# EAGLE design Industrial Switcher (EAGLE 6.4)
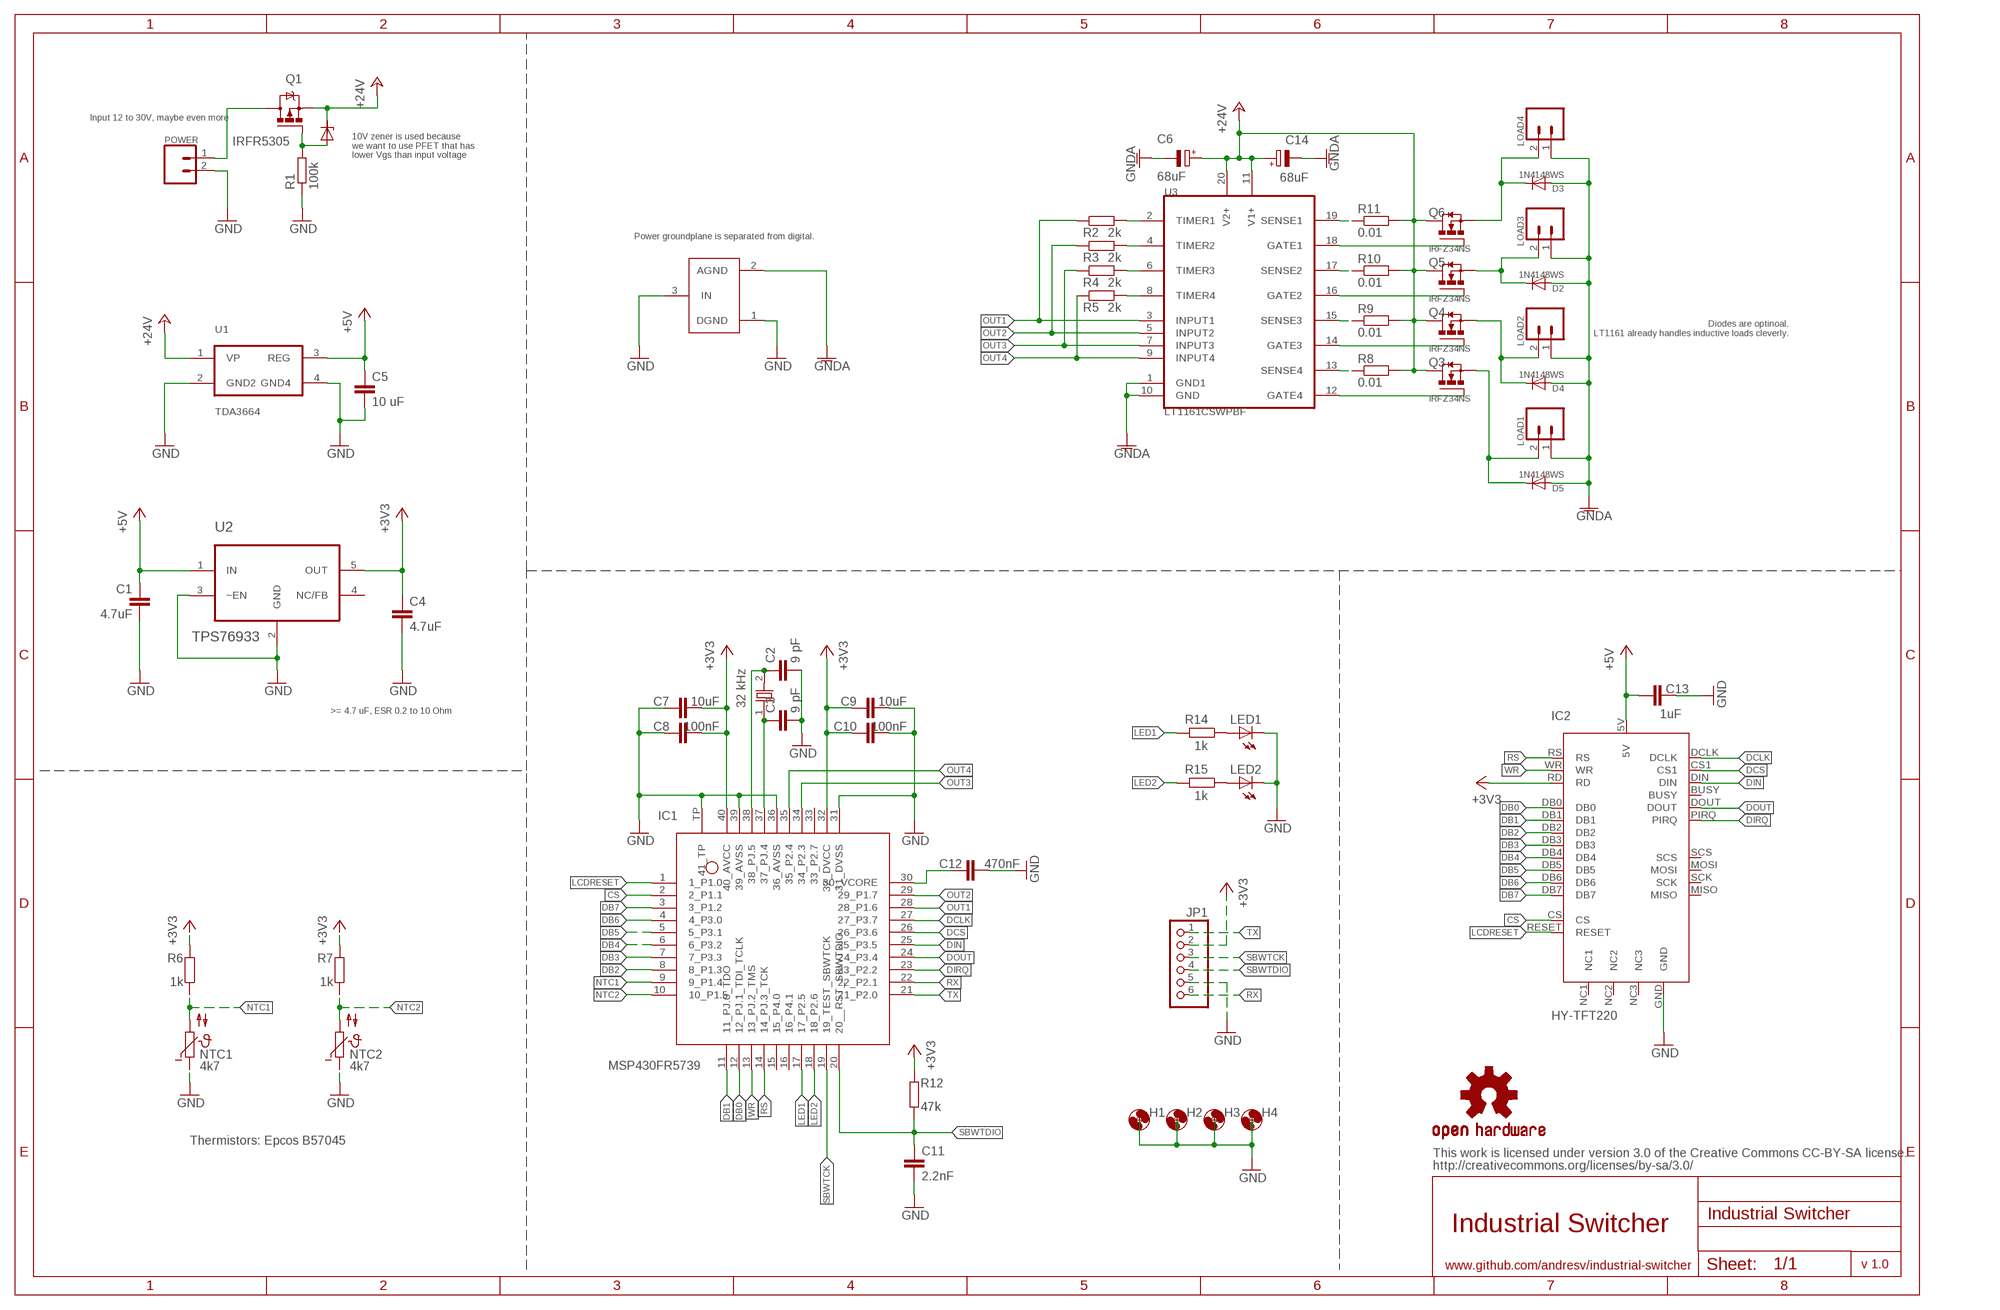
[diagram p0: schematic, sheet 1]

## Parts
C1  4.7uF  C-EUC0805  [C0805]
C2  9 pF  C-EUC0402  [C0402]
C3  9 pF  C-EUC0402  [C0402]
C4  4.7uF  C-EUC1206  [C1206]
C5  10 uF  C-EUC1206  [C1206]
C6  68uF  CPOL-EUF  [PANASONIC_F]
C7  10uF  C-EUC0603  [C0603]
C8  100nF  C-EUC0603  [C0603]
C9  10uF  C-EUC0603  [C0603]
C10  100nF  C-EUC0603  [C0603]
C11  2.2nF  C-EUC0402  [C0402]
C12  470nF  C-EUC0603  [C0603]
C13  1uF  C-EUC0805  [C0805]
C14  68uF  CPOL-EUF  [PANASONIC_F]
D1  10V  ZDIODE-SOD323  [SOD323-W]
D2  1N4148WS  DIODE-SOD323-W  [SOD323-W]
D3  1N4148WS  DIODE-SOD323-W  [SOD323-W]
D4  1N4148WS  DIODE-SOD323-W  [SOD323-W]
D5  1N4148WS  DIODE-SOD323-W  [SOD323-W]
H1  MOUNT-HOLE3.0  [3,0]
H2  MOUNT-HOLE3.0  [3,0]
H3  MOUNT-HOLE3.0  [3,0]
H4  MOUNT-HOLE3.0  [3,0]
IC1  MSP430FR5739  FR57XX--RHA40RHAPACKAGE  [RHA40]
IC2  HY-TFT220  2.2TFT  [2.2TFT]
JP1  PINHD-1X6  [1X06]
LED1  LEDCHIP-LED0603  [CHIP-LED0603]
LED2  LEDCHIP-LED0603  [CHIP-LED0603]
LOAD1  M025MM  [SCREWTERMINAL-5MM-2]
LOAD2  M025MM  [SCREWTERMINAL-5MM-2]
LOAD3  M025MM  [SCREWTERMINAL-5MM-2]
LOAD4  M025MM  [SCREWTERMINAL-5MM-2]
LOGO2  OSHW-LOGOL  [OSHW-LOGO-L]
NTC1  4k7  NTC640-9  [N640]
NTC2  4k7  NTC640-9  [N640]
POWER  M025MM  [SCREWTERMINAL-5MM-2]
Q1  IRFR5305  [D-PAK_TO252AA]
Q2  32 kHz  ABS07  [ABS07]
Q3  IRFZ34NS  IRF3704S  [D2PACK]
Q4  IRFZ34NS  IRF3704S  [D2PACK]
Q5  IRFZ34NS  IRF3704S  [D2PACK]
Q6  IRFZ34NS  IRF3704S  [D2PACK]
R1  100k  R-EU_R0603  [R0603]
R2  2k  R-EU_R0603  [R0603]
R3  2k  R-EU_R0603  [R0603]
R4  2k  R-EU_R0603  [R0603]
R5  2k  R-EU_R0603  [R0603]
R6  1k  R-EU_R0603  [R0603]
R7  1k  R-EU_R0603  [R0603]
R8  0.01  R-EU_R0603  [R0603]
R9  0.01  R-EU_R0603  [R0603]
R10  0.01  R-EU_R0603  [R0603]
R11  0.01  R-EU_R0603  [R0603]
R12  47k  R-EU_R0402  [R0402]
R14  1k  R-EU_R0402  [R0402]
R15  1k  R-EU_R0402  [R0402]
U1  TDA3664  295-TDA3664/N1,135  [DRFRIEDPARTS/DOAAZ]
U2  TPS76933  TPS76933DBVT  [SOT95P280X145-5N]
U3  LT1161CSWPBF  337-LT1161CSWPBF  [ANDRESV/B3JU7]
U$1  GND_CONNECT  [GND_CONNECT]

## Nets
+3V3: C4.1 C7.2 C8.2 C9.1 C10.1 IC1.32(32_DVCC) IC1.40(40_AVCC) IC2.RD JP1.2 R6.2 R7.2 R12.2 U2.5(OUT)
+5V: C1.1 C5.1 C13.2 IC2.5V U1.3(REG) U2.1(IN)
+24V: C6.+ C14.+ D1.C Q1.3(S) Q3.2(D) Q4.2(D) Q5.2(D) Q6.2(D) R8.2 R9.2 R10.2 R11.2 U1.1(VP) U3.11(V1+) U3.20(V2+)
CS: IC1.2(2_P1.1) IC2.CS
DB0: IC1.12(12_PJ.1_TDI_TCLK) IC2.DB0
DB1: IC1.11(11_PJ.0_TDO) IC2.DB1
DB2: IC1.8(8_P1.3) IC2.DB2
DB3: IC1.7(7_P3.3) IC2.DB3
DB4: IC1.6(6_P3.2) IC2.DB4
DB5: IC1.5(5_P3.1) IC2.DB5
DB6: IC1.4(4_P3.0) IC2.DB6
DB7: IC1.3(3_P1.2) IC2.DB7
DCLK: IC1.27(27_P3.7) IC2.DCLK
DCS: IC1.26(26_P3.6) IC2.CS1
DIN: IC1.25(25_P3.5) IC2.DIN
DIRQ: IC1.23(23_P2.2) IC2.PIRQ
DOUT: IC1.24(24_P3.4) IC2.DOUT
GND: C1.2 C2.2 C3.2 C4.2 C5.2 C7.1 C8.1 C9.2 C10.2 C11.2 C12.2 C13.1 IC1.31(31_DVSS) IC1.36(36_AVSS) IC1.39(39_AVSS) IC1.TP(41_TP) IC2.GND JP1.5 LED1.C LED2.C NTC1.1 NTC2.1 POWER.2 R1.1 U1.2(GND2) U1.4(GND4) U2.2(GND) U2.3(~EN) U$1.1(DGND) U$1.3(IN)
GNDA: C6.- C14.- D2.A D3.A D4.A D5.A LOAD1.1 LOAD2.1 LOAD3.1 LOAD4.1 U3.1(GND1) U3.10(GND) U$1.2(AGND)
LCDRESET: IC1.1(1_P1.0) IC2.RESET
LED1: IC1.17(17_P2.5) R14.2
LED2: IC1.18(18_P2.6) R15.2
N$2: D1.A Q1.1(G) R1.2
N$3: R5.2 U3.8(TIMER4)
N$4: R8.1 U3.13(SENSE4)
N$5: R9.1 U3.15(SENSE3)
N$6: D3.C LOAD4.2 Q6.3(S)
N$7: R10.1 U3.17(SENSE2)
N$8: R4.2 U3.6(TIMER3)
N$9: D2.C LOAD3.2 Q5.3(S)
N$10: R11.1 U3.19(SENSE1)
N$11: R3.2 U3.4(TIMER2)
N$12: D4.C LOAD2.2 Q4.3(S)
N$13: POWER.1 Q1.4(D)
N$14: R2.2 U3.2(TIMER1)
N$15: D5.C LOAD1.2 Q3.3(S)
N$18: Q6.1(G) U3.18(GATE1)
N$19: C3.1 IC1.37(37_PJ.4) Q2.1
N$20: C2.1 IC1.38(38_PJ.5) Q2.2
N$21: C12.1 IC1.30(30_VCORE)
N$23: Q5.1(G) U3.16(GATE2)
N$24: Q4.1(G) U3.14(GATE3)
N$25: Q3.1(G) U3.12(GATE4)
N$26: LED1.A R14.1
N$27: LED2.A R15.1
NTC1: IC1.9(9_P1.4) NTC1.2 R6.1
NTC2: IC1.10(10_P1.5) NTC2.2 R7.1
OUT1: IC1.28(28_P1.6) R2.1 U3.3(INPUT1)
OUT2: IC1.29(29_P1.7) R3.1 U3.5(INPUT2)
OUT3: IC1.34(34_P2.3) R4.1 U3.7(INPUT3)
OUT4: IC1.35(35_P2.4) R5.1 U3.9(INPUT4)
RS: IC1.14(14_PJ.3_TCK) IC2.RS
RX: IC1.22(22_P2.1) JP1.6
SBWTCK: IC1.19(19_TEST_SBWTCK) JP1.3
SBWTDIO: C11.1 IC1.20(20__RST_SBWTDIO) JP1.4 R12.1
TX: IC1.21(21_P2.0) JP1.1
WR: IC1.13(13_PJ.2_TMS) IC2.WR
Unconnected: IC1.15(15_P4.0) IC1.16(16_P4.1) IC1.33(33_P2.7) IC2.BUSY IC2.MISO IC2.MOSI IC2.NC1 IC2.NC2 IC2.NC3 IC2.SCK IC2.SCS U2.4(NC/FB)

## Notes on the sheet
- Input 12 to 30V, maybe even more
- 10V zener is used because
  we want to use PFET that has
  lower Vgs than input voltage
- Power groundplane is separated from digital.
- Diodes are optinoal.
  LT1161 already handles inductive loads cleverly.
- >= 4.7 uF, ESR 0.2 to 10 Ohm
- Thermistors: Epcos B57045
- This work is licensed under version 3.0 of the Creative Commons CC-BY-SA license.
- http://creativecommons.org/licenses/by-sa/3.0/
- Industrial Switcher
- www.github.com/andresv/industrial-switcher | v 1.0

## Library data of the parts
C1-C5 C7-C13 = rcl:C-EU: CAPACITOR, European symbol
C6 C14 = rcl:CPOL-EU: POLARIZED CAPACITOR, European symbol
D1 = General:ZDIODE-SOD323: Z DIODE
D2-D5 = diode:DIODE-: DIODE
H1-H4 = holes:MOUNT-HOLE: MOUNTING HOLE with drill center marker
IC1 = TI_MSP430_v16:FR57XX--RHA40: *** MSP430FR57xx *** 40-PIN RHA (QFN) ***
IC2 = General:2.2TFT: http://www.ebay.com/itm/2-2-TFT-LCD-Module-Touch-Panel-Screen-PCB-Adpater-SD-Card-Cage-/170734608691?pt=LH_DefaultDomain_0&hash=item27c0936133
JP1 = pinhead:PINHD-1X6: PIN HEADER
LED1 LED2 = led:LED: LED OSRAM: - CHIPLED LG R971, LG N971, LY N971, LG Q971, LY Q971, LO R971, LY R971 LH N974, LH R974 LS Q976, LO Q976, LY Q976 LO Q996 - Hyper CHIPLED LW Q18S LB Q993, LB Q99A, LB R99A - SideLED LS A670, LO A670, LY A670, LG A670, LP A670 LB A673, LV A673, LT A673, LW A673 LH A674 LY A675 LS A676, LA A676, LO A676, LY A676, LW A676 LS A679, LY A679, LG A679 - Hyper Micro SIDELED® LS Y876, LA Y876, LO Y876, LY Y876 LT Y87S - SmartLED LW L88C, LW L88S LB L89C, LB L89S, LG L890 LS L89K, LO L89K, LY L89K LS L896, LA L896, LO L896, LY L896 - TOPLED LS T670, LO T670, LY T670, LG T670, LP T670 LSG T670, LSP T670, LSY T670, LOP T670, LYG T670 LG T671, LOG T671, LSG T671 LB T673, LV T673, LT T673, LW T673 LH T674 LS T676, LA T676, LO T676, LY T676, LB T676, LH T676, LSB T676, LW T676 LB T67C, LV T67C, LT T67C, LS T67K, LO T67K, LY T67K, LW E67C LS E67B, LA E67B, LO E67B, LY E67B, LB E67C, LV E67C, LT E67C LW T67C LS T679, LY T679, LG T679 LS T770, LO T770, LY T770, LG T770, LP T770 LB T773, LV T773, LT T773, LW T773 LH T774 LS E675, LA E675, LY E675, LS T675 LS T776, LA T776, LO T776, LY T776, LB T776 LHGB T686 LT T68C, LB T68C - Hyper Mini TOPLED® LB M676 - Mini TOPLED Santana® LG M470 LS M47K, LO M47K, LY M47K Source: http://www.osram.convergy.de LUXEON: - LUMILED® LXK2-PW12-R00, LXK2-PW12-S00, LXK2-PW14-U00, LXK2-PW14-V00 LXK2-PM12-R00, LXK2-PM12-S00, LXK2-PM14-U00 LXK2-PE12-Q00, LXK2-PE12-R00, LXK2-PE12-S00, LXK2-PE14-T00, LXK2-PE14-U00 LXK2-PB12-K00, LXK2-PB12-L00, LXK2-PB12-M00, LXK2-PB14-N00, LXK2-PB14-P00, LXK2-PB14-Q00 LXK2-PR12-L00, LXK2-PR12-M00, LXK2-PR14-Q00, LXK2-PR14-R00 LXK2-PD12-Q00, LXK2-PD12-R00, LXK2-PD12-S00 LXK2-PH12-R00, LXK2-PH12-S00 LXK2-PL12-P00, LXK2-PL12-Q00, LXK2-PL12-R00 Source: www.luxeon.com KINGBRIGHT: KA-3528ASYC Source: www.kingbright.com
LOAD1-LOAD4 POWER = SparkFun:M02: Header 2 Standard 2-pin 0.1" header. Use with straight break away headers (SKU : PRT-00116), right angle break away headers (PRT-00553), swiss pins (PRT-00743), machine pins (PRT-00117), and female headers (PRT-00115). Molex polarized connector foot print use with SKU : PRT-08233 with associated crimp pins and housings.
LOGO2 = SparkFun-Aesthetics:OSHW-LOGO: Open Source Hardware Logo This logo indicates the piece of hardware it is found on incorporates a OSHW license and/or adheres to the definition of open source hardware found here: http://freedomdefined.org/OSHW
NTC1 NTC2 = ptc-ntc:NTC640-9: PHILIPS NTC; OC_FARNELL: unknown; OC_NEWARK: unknown
Q1 = transistor-power:IRF?5305: HEXFET Power MOSFET Source: http://www.irf.com/product-info/datasheets/data/irfr5305pbf.pdf
Q2 = abracon_crystals:ABS07
Q3-Q6 = transistor-power:IRF3704: SMPS MOSFET HEXFET® Power MOSFET Source: http://www.irf.com/product-info/datasheets/data/irf3704.pdf
R1-R12 R14 R15 = rcl:R-EU_: RESISTOR, European symbol
U1 = CircuitHub:295-TDA3664/N1,135; URL: https://circuithub.com/parts/NS/TDA3664%2FN1%2C135
U2 = TPS76933:TPS76933DBVT: ULTRALOW-POWER 100-mA LOW-DROPOUT LINEAR REGULATORS; MPN: TPS76933DBVT; OC_FARNELL: 8461538; OC_NEWARK: 77C1165; PACKAGE: SOT-23-5; SUPPLIER: Texas Instruments
U3 = CircuitHub:337-LT1161CSWPBF; URL: https://circuithub.com/parts/LINEAR/LT1161CSW%23PBF
U$1 = SparkFun-Passives:GND_CONNECT: Use to make a connection of multiple grounds in only one place.

## Board
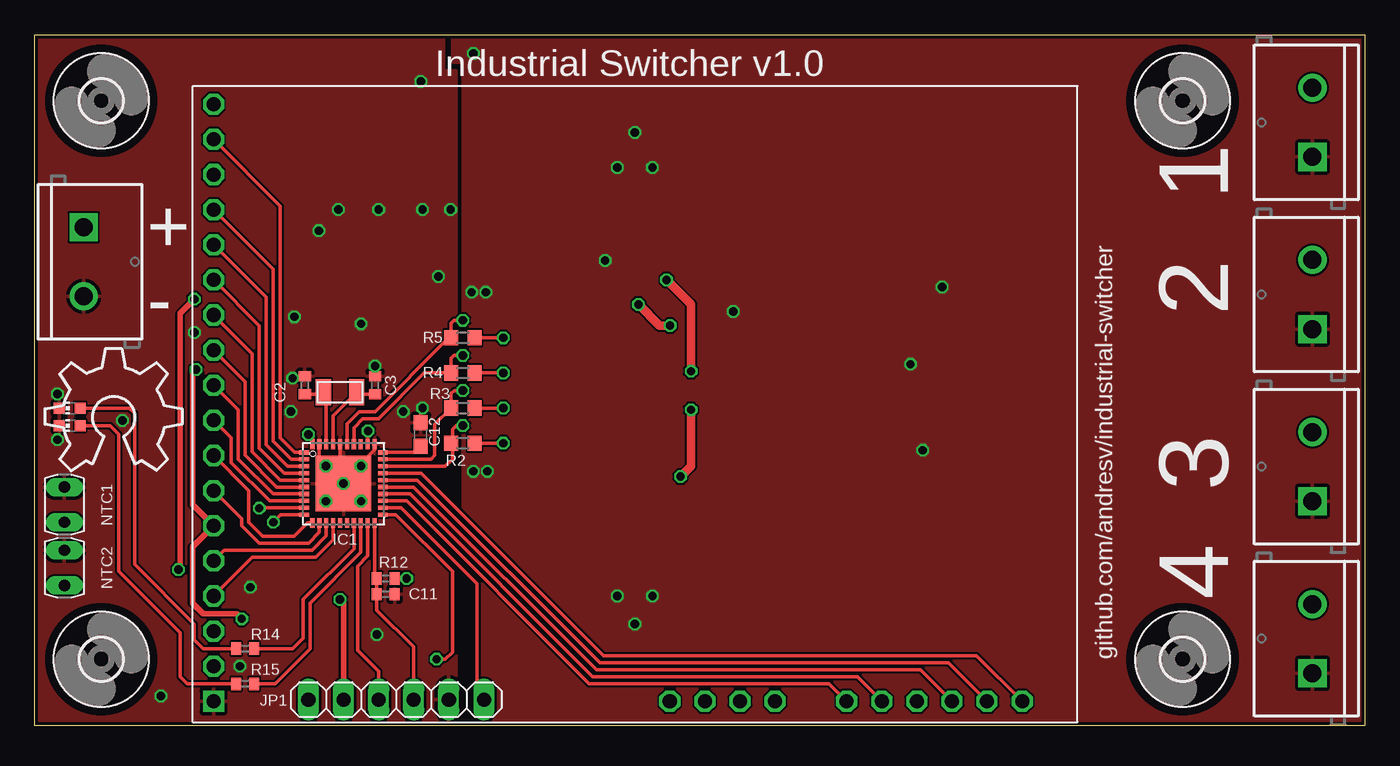
[diagram p1: board, top side]
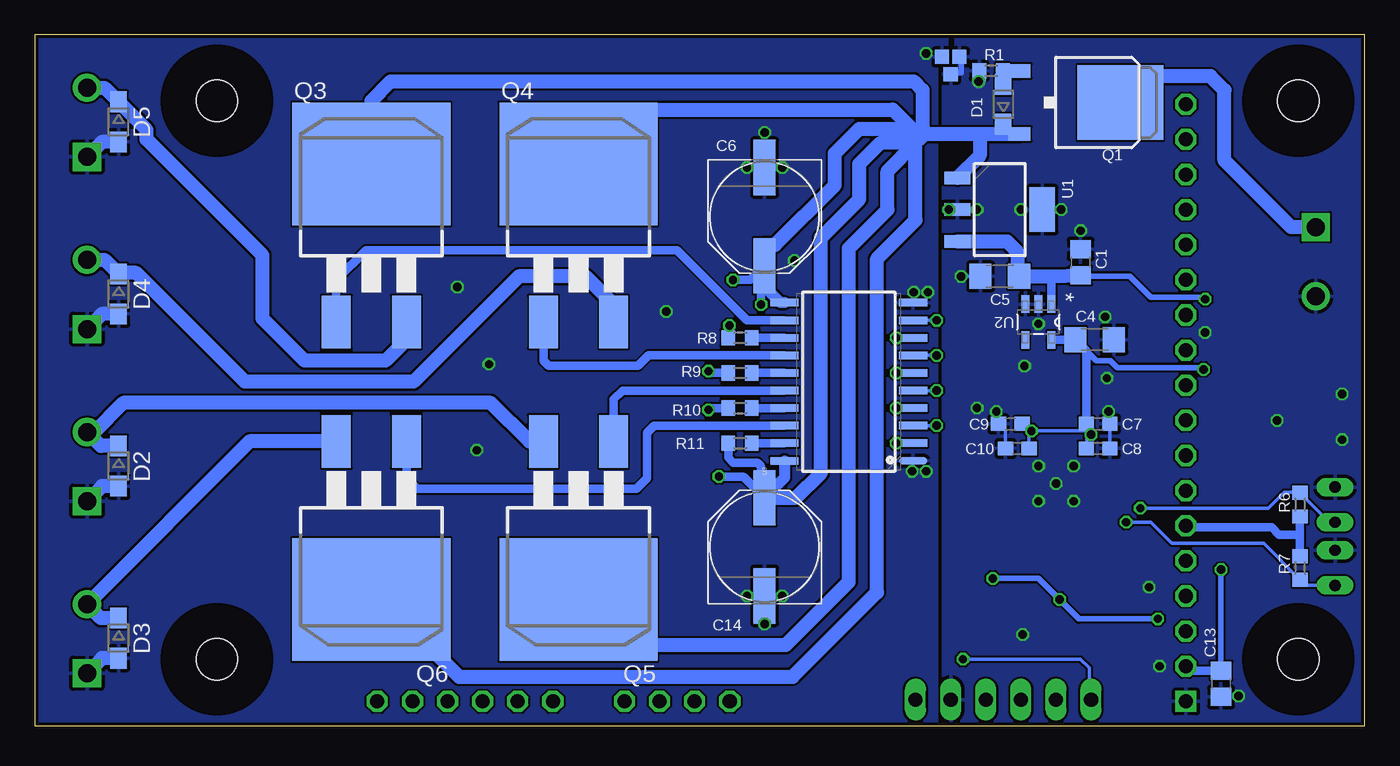
[diagram p2: board, bottom side, seen from below]

Size 96.25 x 50 mm. Coordinates in mm from the lower left corner, seen from the top.
Outline: 0,0 0,50 96.25,50 96.25,0 0,0
Copper layers (1*16): Top 0.035mm / dielectric 1.5mm / Bottom 0.035mm
Design rules "ITEADstudio_DRC": minimum track width 6mil, minimum drill 12mil, track to track 6mil, track to pad 6mil, pad to pad 6mil, via to via 6mil, smd to smd 0mil, copper to edge 10mil, drill to drill 10mil, minimum pad ring 10mil, minimum via ring 6mil, stop-mask expansion 2mil, vias tented up to drill 100mil, thermal gap 10mil

### Footprints (pad centres in the part's own frame; a part is rotated, then mirrored left to right if it is on the bottom)
C0805 = smd 1.3 x 1.5: 1 -0.95,0; 2 0.95,0
C0402 = smd 0.7 x 0.9: 1 -0.65,0; 2 0.65,0
C1206 = smd 1.6 x 1.8: 1 -1.4,0; 2 1.4,0
PANASONIC_F = smd 4 x 1.6: + 3.55,0; - -3.55,0
C0603 = smd 1.1 x 1: 1 -0.85,0; 2 0.85,0
SOD323-W = smd 1.5 x 1.2: A 1.45,0; C -1.45,0
3,0 = hole 3: 0,0
RHA40 = smd 0.7 x 0.3: 1 -2.85,2.25; 2 -2.85,1.75; 3 -2.85,1.25; 4 -2.85,0.75; 5 -2.85,0.25; 6 -2.85,-0.25; 7 -2.85,-0.75; 8 -2.85,-1.25; 9 -2.85,-1.75; 10 -2.85,-2.25; 21 2.85,-2.25; 22 2.85,-1.75; 23 2.85,-1.25; 24 2.85,-0.75; 25 2.85,-0.25; 26 2.85,0.25; 27 2.85,0.75; 28 2.85,1.25; 29 2.85,1.75; 30 2.85,2.25 | smd 0.3 x 0.7: 11 -2.25,-2.85; 12 -1.75,-2.85; 13 -1.25,-2.85; 14 -0.75,-2.85; 15 -0.25,-2.85; 16 0.25,-2.85; 17 0.75,-2.85; 18 1.25,-2.85; 19 1.75,-2.85; 20 2.25,-2.85; 31 2.25,2.85; 32 1.75,2.85; 33 1.25,2.85; 34 0.75,2.85; 35 0.25,2.85; 36 -0.25,2.85; 37 -0.75,2.85; 38 -1.25,2.85; 39 -1.75,2.85; 40 -2.25,2.85 | smd 4 x 4: TP 0,0
2.2TFT = drill 1.016 octagon: 5V -2.54,0; BUSY 0,50.88; CS -35.56,0; CS1 0,55.96; DB0 -15.24,0; DB1 -17.78,0; DB2 -20.32,0; DB3 -22.86,0; DB4 -25.4,0; DB5 -27.94,0; DB6 -30.48,0; DB7 -33.02,0; DCLK 0,58.5; DIN 0,53.42; DOUT 0,48.34; MISO 0,33; MOSI 0,38.08; NC1 -5.08,0; NC2 -38.1,0; NC3 -43.18,0; PIRQ 0,45.8; RD -12.7,0; RESET -40.64,0; RS -7.62,0; SCK 0,35.54; SCS 0,40.62; WR -10.16,0 | drill 1.016 square: GND 0,0
1X06 = drill 1.016 long: 1 -6.35,0; 2 -3.81,0; 3 -1.27,0; 4 1.27,0; 5 3.81,0; 6 6.35,0
CHIP-LED0603 = smd 0.8 x 0.8: A 0,-0.75; C 0,0.75
SCREWTERMINAL-5MM-2 = drill 1.3 pad 2.032 square: 1 0,0 | drill 1.3 pad 2.032: 2 5,0
N640 = drill 0.813 long: 1 -1.27,0; 2 1.27,0
D-PAK_TO252AA = smd 1 x 1.6: 1 -2.28,-4.8; 3 2.28,-4.8 | smd 5.4 x 6.2: 4 0,2.5
ABS07 = smd 1.1 x 1.9: 1 1.2,0; 2 -1.2,0
D2PACK = smd 2.083 x 3.81: 1 -2.54,-8.89; 3 2.54,-8.89 | smd 11.43 x 8.89: 2 0,2.54
R0603 = smd 1 x 1.1: 1 -0.85,0; 2 0.85,0
R0402 = smd 0.7 x 0.9: 1 -0.65,0; 2 0.65,0
DRFRIEDPARTS/DOAAZ = smd 0.91 x 1.876: 1 -2.3,-3.062; 2 0,-3.062; 3 2.3,-3.062 | smd 3.21 x 1.876: 4 0,3.062
SOT95P280X145-5N = smd 1.27 x 0.559: 1 -1.295,0.94; 2 -1.295,0; 3 -1.295,-0.94; 4 1.295,-0.94; 5 1.295,0.94
ANDRESV/B3JU7 = smd 0.542 x 2.041: 1 -5.715,-4.651; 2 -4.445,-4.651; 3 -3.175,-4.651; 4 -1.905,-4.651; 5 -0.635,-4.651; 6 0.635,-4.651; 7 1.905,-4.651; 8 3.175,-4.651; 9 4.445,-4.651; 10 5.715,-4.651; 11 5.715,4.651; 12 4.445,4.651; 13 3.175,4.651; 14 1.905,4.651; 15 0.635,4.651; 16 -0.635,4.651; 17 -1.905,4.651; 18 -3.175,4.651; 19 -4.445,4.651; 20 -5.715,4.651
GND_CONNECT = smd 1.016 x 1.016: 1 -1.016,0; 2 -1.016,-1.27; 3 0.254,-0.635

### Placement (x,y rotation side)
C1  20.57,33.53 90 bottom
C2  19.56,24.64 90 top
C3  24.64,24.64 90 top
C4  19.56,27.94 0 bottom
C5  26.42,32.51 180 bottom
C6  43.43,36.83 270 bottom
C7  19.3,21.84 180 bottom
C8  19.3,20.07 180 bottom
C9  25.65,21.84 180 bottom
C10  25.15,20.07 180 bottom
C11  25.4,9.53 0 top
C12  27.94,21.08 90 top
C13  10.41,3.05 90 bottom
C14  43.43,12.95 90 bottom
D1  26.16,44.96 90 bottom
D2  90.17,18.8 270 bottom
D3  90.17,6.35 270 bottom
D4  90.17,31.24 270 bottom
D5  90.17,43.69 270 bottom
H1  83.06,45.21 0 top
H2  83.06,4.83 0 top
H3  4.83,4.83 0 top
H4  4.83,45.21 0 top
IC1  22.35,17.53 0 top
IC2  12.95,1.78 270 top
JP1  26.16,1.91 0 top
LED1  2.54,22.99 90 top
LED2  2.54,21.72 90 top
LOAD1  92.46,41.15 90 top
LOAD2  92.46,28.7 90 top
LOAD3  92.46,16.26 90 top
LOAD4  92.46,3.81 90 top
LOGO1  OSHW_LOGO_8MILX0350-NT  [OSHW_8X350_NOTEXT]  0.77,18.45 0 top
NTC1  2.16,16 270 top
NTC2  2.16,11.43 270 top
POWER  3.56,36.07 270 top
Q1  20.19,45.09 270 bottom
Q2  22.1,24.13 0 top
Q3  71.88,38.1 0 bottom
Q4  56.9,38.1 0 bottom
Q5  56.9,11.68 180 bottom
Q6  71.88,11.68 180 bottom
R1  27.05,47.37 0 bottom
R2  30.99,20.45 0 top
R3  30.99,22.99 0 top
R4  30.99,25.53 0 top
R5  30.99,28.07 0 top
R6  4.7,16 270 bottom
R7  4.7,11.43 90 bottom
R8  45.21,28.07 180 bottom
R9  45.21,25.53 180 bottom
R10  45.21,22.99 180 bottom
R11  45.21,20.45 180 bottom
R12  25.4,10.67 0 top
R14  15.24,5.59 0 top
R15  15.24,3.05 0 top
U1  26.42,37.34 270 bottom
U2  23.62,29.21 270 bottom
U3  37.34,24.89 90 bottom
U$1  29.34,47.37 270 bottom

### Tracks (layer width: path | path; a pad name or v marks a point on that pad's centre or on a via)
+3V3  (via drill 0.6)
  Top 0.254: IC1.40 20.1,20.79 v19.81,21.08 | IC1.32 24.1,21.31 v24.13,21.34
  Top 0.406: JP1.2 22.35,8.89 v22.1,9.14 | R12.2 v26.92,10.67 | v14.99,7.75 14.61,8.13 12.19,8.13 11.43,8.89 11.43,12.95 IC2.RD 11.43,16 11.43,25.53 v11.68,25.78
  Bottom 0.254: v19.81,21.08 19.81,21.5 C7.2 | C8.2 20.15,20.32 IC1.40 20.1,20.79 v19.81,21.08 | v24.13,21.34 24.13,21.42 C9.1 | C10.1 24.3,21.17 v24.13,21.34 | v24.13,21.34 20.07,21.34 v19.81,21.08
  Bottom 0.406: v26.92,10.67 23.62,10.67 v22.1,9.14 20.7,7.75 v14.99,7.75 | v11.68,25.78 11.81,25.91 17.91,25.91 18.41,26.42 19.43,26.42 20.15,27.14
  Bottom 0.61: U2.5 20.98,27.91 C4.1 20.15,27.14 C7.2 | R6.2 4.7,13.84 | R7.2 4.7,13.84 | 4.7,13.84 6.22,13.84 6.73,14.35 12.83,14.35 IC2.RD
+5V  (via drill 0.6)
  Top 0.406: v10.41,11.3 10.54,11.43 10.54,29.84 v11.56,30.86
  Bottom 0.406: C1.1 20.51,32.51 17.02,32.51 15.49,30.99 11.68,30.99 v11.56,30.86 | C13.2 v10.41,11.3
  Bottom 0.61: U2.1 22.68,32.44 22.61,32.51 | C13.2 12.63,4 IC2.5V
  Bottom 1.016: U1.3 25.89,35.04 25.15,34.29 25.15,32.64 C5.1 22.61,32.51 C1.1
+24V  (via drill 0.6)
  Top 0.61: v47.5,22.86 47.5,18.8 v46.74,18.03 | v47.5,25.65 47.5,30.48 v45.72,32.26 | v45.97,28.96 45.21,28.96 v43.69,30.48
  Bottom 0.61: R10.2 47.37,22.99 v47.5,22.86 | v46.74,18.03 44.96,18.03 C14.+ | R11.2 46.06,19.39 45.72,19.05 43.94,19.05 43.69,18.8 43.69,17.78 42.92,17.02 | R9.2 47.37,25.53 v47.5,25.65 | v45.72,32.26 44.46,32.26 C6.+ | R8.2 46.06,28.87 v45.97,28.96 | v43.69,30.48 43.69,32 43.43,32.26
  Bottom 0.813: U3.20 41.99,17.95 42.92,17.02 C14.+ | U3.11 42.29,30.61 43.43,31.75 43.43,32.26 C6.+
  Bottom 1.016: Q5.2 53.59,5.84 41.91,5.84 37.34,10.41 37.34,34.54 34.54,37.34 34.54,40.13 32.51,42.16 | C14.+ 41.15,16.5 39.37,18.29 39.37,35.31 36.58,38.1 36.58,40.64 35.05,42.16 32.51,42.16 | C6.+ 43.43,34.8 42.67,34.8 38.35,39.12 38.35,41.4 36.58,43.18 33.53,43.18 32.51,42.16 | Q6.2 71.12,9.14 65.53,3.56 41.4,3.56 35.31,9.65 35.31,33.78 32.51,36.58 32.51,42.16 | Q4.2 55.5,40.64 51.56,44.58 34.16,44.58 32.13,42.55 | Q3.2 71.88,45.21 70.48,46.61 32.64,46.61 32,45.97 32,43.18 31.75,42.93 | Q1.3 26.16,42.8 | 26.16,42.8 27.87,42.8 | 27.87,42.8 27.87,41.24 U1.1 | 32.51,42.16 32.13,42.55 | 32.13,42.55 31.75,42.93 | D1.C 26.16,42.8 | 27.87,42.8 31.63,42.8 31.75,42.93
CS
  Top 0.254: IC1.2 18.57,19.28 17.27,20.57 17.27,33.02 IC2.CS
DB0
  Top 0.254: IC1.12 20.6,14 19.81,13.21 16.26,13.21 14.99,14.48 14.99,14.99 IC2.DB0
DB1
  Top 0.254: IC1.11 19.76,14.68 18.8,13.72 16.51,13.72 15.49,14.73 15.49,17.02 IC2.DB1
DB2
  Top 0.254: IC1.8 17,16.28 14.22,19.05 14.22,20.83 IC2.DB2
DB3
  Top 0.254: IC1.7 17.26,16.78 14.73,19.3 14.73,22.86 IC2.DB3
DB4
  Top 0.254: IC1.6 17.52,17.28 15.24,19.56 15.24,24.89 IC2.DB4
DB5
  Top 0.254: IC1.5 17.78,17.78 15.75,19.81 15.75,26.92 IC2.DB5
DB6
  Top 0.254: IC1.4 18.05,18.28 16.26,20.07 16.26,28.96 IC2.DB6
DB7
  Top 0.254: IC1.3 18.31,18.78 16.76,20.32 16.76,30.99 IC2.DB7
DCLK
  Top 0.254: IC1.27 27.95,18.28 41.15,5.08 68.15,5.08 IC2.DCLK
DCS
  Top 0.254: IC1.26 27.69,17.78 40.89,4.57 66.12,4.57 IC2.CS1
DIN
  Top 0.254: IC1.25 27.43,17.28 40.64,4.06 64.09,4.06 IC2.DIN
DIRQ
  Top 0.254: IC1.23 26.9,16.28 40.13,3.05 57.48,3.05 IC2.PIRQ
DOUT
  Top 0.254: IC1.24 27.17,16.78 40.39,3.56 59.52,3.56 IC2.DOUT
GND  (via drill 0.6)
  Top 0.254: C12.2 27.94,22.86 v28.07,22.99 | C2.2 18.81,25.29 v18.67,25.15 | C3.2 v24.64,26.04 | IC1.39 20.6,19.28 v21.08,18.8 | IC1.36 22.1,17.78 IC1.TP | 23.62,18.92 v23.62,18.8 23.93,19.1 23.93,19.3 24.6,19.98 IC1.31
  Bottom 0.254: v18.54,22.73 18.45,22.64 C7.1 C8.1 | v26.67,22.73 26.5,22.57 C9.2 26,21.34 C10.2 | C5.2 v29.21,32.51 | U1.4 v21.97,37.34 | U1.2 v28.07,37.34
  Bottom 0.406: U$1.1 29.21,48.39 29.21,47.24 29.97,47.24 U$1.3
  Bottom 1.016: R1.1 27.9,47.28 v27.94,46.61
  other vias: 22.35,17.53 23.62,16.26 21.08,16.26 30.1,37.34 24.89,37.34 23.62,29.08 20.57,35.81 18.8,29.59 24.77,6.6 15.62,10.03 14.86,4.32 11.56,28.45 9.14,2.16 6.35,22.1 1.65,20.7 1.65,24
  pour Bottom: 0,50.04 29.59,50.04 29.59,47.37 30.48,47.37 30.48,0 0,0
  pour Top: 0,0 0,50.04 29.59,50.04 29.59,47.37 30.48,47.37 30.48,0
GNDA  (via drill 0.6)
  Bottom 0.254: C6.- v44.7,40.38 v44.7,40.39 | C14.- 44.83,9.4 v44.7,9.4 | U3.10 32.69,31.32 v32.64,31.37 | U3.1 32.69,18.49 v32.77,18.41
  Bottom 1.016: D3.A 91.37,4.9 LOAD4.1 | D2.A 91.37,17.35 LOAD3.1 | D4.A 91.37,29.79 LOAD2.1 | D5.A 91.37,42.24 LOAD1.1
  other vias: 41.27,33.66 42.16,40.39 43.43,42.93 42.16,9.4 43.43,7.37 50.55,29.97 64.26,19.94 63.37,26.16 65.66,31.75 31.62,31.37 31.75,18.41 31.75,48.64
  pour Bottom: 96.27,50.04 30.23,50.04 30.23,48.01 30.99,48.01 30.99,0 96.27,0
  pour Top: 96.27,50.04 30.23,50.04 30.23,48.01 30.99,48.01 30.99,0 96.27,0
LCDRESET
  Top 0.254: IC1.1 18.83,19.78 17.78,20.83 17.78,37.59 IC2.RESET
LED1
  Top 0.254: IC1.17 23.1,12.81 19.43,9.14 19.43,6.35 18.67,5.59 R14.2
LED2
  Top 0.254: IC1.18 23.6,12.55 19.94,8.89 19.94,5.59 17.4,3.05 R15.2
N$2
  Bottom 1.016: D1.A 26.2,46.45 R1.2 Q1.1
N$3  (via drill 0.6)
  Top 0.254: R5.2 v33.91,28.07
  Bottom 0.254: v33.91,28.07 U3.8
N$4
  Bottom 0.61: U3.13 R8.1
N$5
  Bottom 0.61: U3.15 R9.1
N$6
  Bottom 1.016: Q6.3 80.69,20.57 LOAD4.2 91.45,7.8 D3.C
N$7
  Bottom 0.61: U3.17 R10.1
N$8  (via drill 0.6)
  Top 0.254: R4.2 v33.91,25.53
  Bottom 0.254: v33.91,25.53 U3.6
N$9
  Bottom 1.016: Q5.3 60.45,20.57 63.25,23.37 89.84,23.37 91.95,21.26 LOAD3.2 91.45,20.25 D2.C
N$10
  Bottom 0.61: U3.19 R11.1
N$11  (via drill 0.6)
  Top 0.254: R3.2 v33.91,22.99
  Bottom 0.254: v33.91,22.99 U3.4
N$12
  Bottom 1.016: Q4.3 54.36,30.48 56.39,32.51 61.21,32.51 68.83,24.89 81.03,24.89 88.9,32.77 90.1,32.77 D4.C 91.18,33.7 LOAD2.2
N$13
  Bottom 1.016: Q1.4 18.71,46.99 11.18,46.99 10.16,45.97 10.16,40.89 5.33,36.07 POWER.1
N$14  (via drill 0.6)
  Top 0.254: R2.2 v33.91,20.45
  Bottom 0.254: v33.91,20.45 U3.2
N$15
  Bottom 1.016: Q3.3 69.34,27.94 70.87,26.42 76.71,26.42 79.76,29.46 79.76,34.04 88.14,42.42 88.14,43.11 D5.C 91.18,46.15 LOAD1.2
N$18
  Bottom 0.61: U3.18 51.44,21.72 51.94,21.21 51.94,17.91 52.7,17.14 68.58,17.14 69.34,17.91 Q6.1
N$19
  Top 0.254: IC1.37 21.6,22.43 Q2.1 23.44,23.99 C3.1
N$20
  Top 0.254: IC1.38 21.1,23.67 Q2.2 20.76,23.99 C2.1
N$21
  Top 0.254: IC1.30 27.74,19.78 C12.1
N$23
  Bottom 0.61: U3.16 53.72,24.26 54.36,23.62 Q5.1
N$24
  Bottom 0.61: U3.14 51.82,26.8 52.58,26.04 59.05,26.04 59.44,26.42 Q4.1
N$25
  Bottom 0.61: U3.12 44.7,29.34 49.78,34.42 72.26,34.42 74.42,32.26 Q3.1
N$26
  Top 0.254: LED1.A 6.86,22.99 7.24,22.61 7.24,11.68 11.56,7.37 11.56,6.22 12.19,5.59 R14.1
N$27
  Top 0.254: LED2.A 5.46,21.72 6.1,21.08 6.1,11.18 10.54,6.73 10.54,3.56 11.05,3.05 R15.1
NTC1  (via drill 0.6)
  Top 0.254: IC1.9 16.54,15.78 v16.26,15.75
  Bottom 0.254: v16.26,15.75 6.99,15.75 5.84,16.89 4.74,16.89 R6.1 2.58,14.73 NTC1.2
NTC2  (via drill 0.6)
  Top 0.254: IC1.10 17.82,15.28 v17.27,14.73
  Bottom 0.254: NTC2.2 4.28,10.16 R7.1 7.33,13.21 13.97,13.21 15.49,14.73 v17.27,14.73
OUT1  (via drill 0.6)
  Top 0.254: 30.23,20.36 30.23,19.3 29.7,18.78 IC1.28 | 30.23,20.36 R2.1 | 30.23,20.36 30.23,21.46 30.48,21.72 v30.99,21.72
  Bottom 0.254: v30.99,21.72 U3.3
OUT2  (via drill 0.6)
  Top 0.254: v30.99,24.26 30.35,24.26 30.14,24.04 R3.1 28.96,21.8 28.96,19.56 28.67,19.28 IC1.29
  Bottom 0.254: v30.99,24.26 U3.5
OUT3  (via drill 0.6)
  Top 0.254: IC1.34 23.1,21.58 23.75,22.23 24.89,22.23 28.19,25.53 R4.1 30.14,26.58 30.35,26.8 v30.99,26.8
  Bottom 0.254: v30.99,26.8 U3.7
OUT4  (via drill 0.6)
  Top 0.254: IC1.35 22.6,21.84 23.5,22.73 24.64,22.73 29.72,27.81 29.88,27.81 R5.1 30.14,29.12 30.35,29.34 v30.99,29.34
  Bottom 0.254: v30.99,29.34 U3.9
RS
  Top 0.254: IC1.14 21.6,13.47 20.32,12.19 15.75,12.19 IC2.RS
RX
  Top 0.254: IC1.22 26.52,15.78 32,10.29 32,2.41 JP1.6
SBWTCK
  Top 0.254: IC1.19 24.1,12.29 23.37,11.56 23.37,5.46 24.89,3.94 JP1.3
SBWTDIO
  Top 0.254: IC1.20 24.6,10.82 R12.1 | JP1.4 27.43,5.71 24.77,8.38 24.77,9.51 C11.1 R12.1 | 24.77,10.65 R12.1
TX  (via drill 0.6)
  Top 0.254: IC1.21 26.13,15.28 30.23,11.18 30.23,5.33 29.72,4.83 v29.08,4.83
  Bottom 0.254: v29.08,4.83 20.57,4.83 19.94,4.19 19.94,2.03 JP1.1
WR
  Top 0.254: IC1.13 21.1,13.74 20.07,12.7 13.72,12.7 IC2.WR

### Text on the board
tNames: Industrial Switcher v1.0 | 1 | + | 2 | - | 3 | 4 | github.com/andresv/industrial-switcher